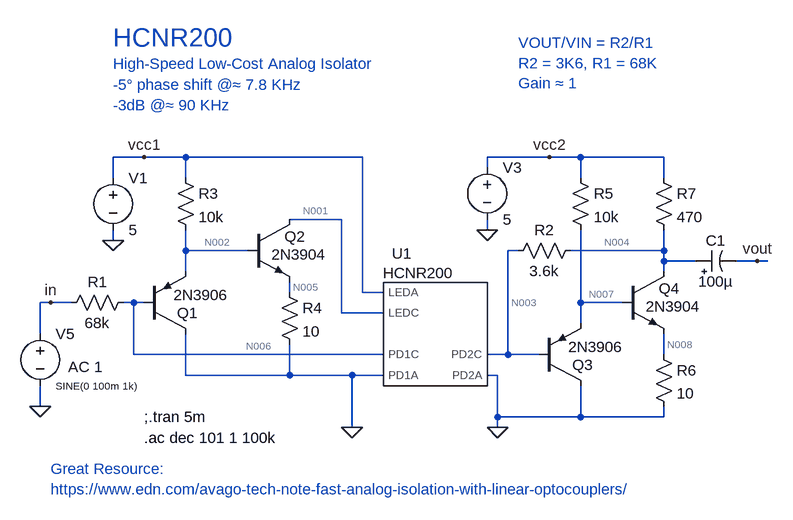
[diagram p0: schematic 03-hcnr200_hs_analog_isolator.asc]
03-hcnr200_hs_analog_isolator.asc, the LTspice schematic file:
Version 4
SHEET 1 1020 724
WIRE -32 -64 -80 -64
WIRE 32 -64 -32 -64
WIRE 304 -64 32 -64
WIRE 592 -64 496 -64
WIRE 640 -64 592 -64
WIRE 768 -64 640 -64
WIRE 496 -48 496 -64
WIRE -80 -32 -80 -64
WIRE 32 -32 32 -64
WIRE 640 -32 640 -64
WIRE 768 -32 768 -64
WIRE 272 32 192 32
WIRE 496 48 496 32
WIRE -80 64 -80 48
WIRE 32 80 32 48
WIRE 128 80 32 80
WIRE 544 80 528 80
WIRE 768 80 768 48
WIRE 768 80 624 80
WIRE 768 96 768 80
WIRE 816 96 768 96
WIRE 912 96 880 96
WIRE 928 96 912 96
WIRE 32 112 32 80
WIRE 768 112 768 96
WIRE 192 144 192 128
WIRE 304 144 304 -64
WIRE 336 144 304 144
WIRE -176 160 -192 160
WIRE -144 160 -176 160
WIRE -48 160 -64 160
WIRE -32 160 -48 160
WIRE 640 160 640 48
WIRE 704 160 640 160
WIRE 272 176 272 32
WIRE 336 176 272 176
WIRE 640 192 640 160
WIRE -192 208 -192 160
WIRE -48 240 -48 160
WIRE 336 240 -48 240
WIRE 528 240 528 80
WIRE 528 240 496 240
WIRE 576 240 528 240
WIRE 768 240 768 208
WIRE 32 272 32 208
WIRE 192 272 192 224
WIRE 192 272 32 272
WIRE 288 272 192 272
WIRE 336 272 288 272
WIRE 512 272 496 272
WIRE -192 320 -192 288
WIRE 512 336 512 272
WIRE 640 336 640 288
WIRE 640 336 512 336
WIRE 768 336 768 320
WIRE 768 336 640 336
WIRE 288 352 288 272
WIRE 512 352 512 336
FLAG -192 320 0
FLAG -176 160 in
FLAG 592 -64 vcc2
FLAG -80 64 0
FLAG 496 48 0
FLAG -32 -64 vcc1
FLAG 288 352 0
FLAG 512 352 0
FLAG 912 96 vout
SYMBOL voltage -80 -48 R0
WINDOW 123 0 0 Left 0
WINDOW 39 0 0 Left 0
SYMATTR InstName V1
SYMATTR Value 5
SYMBOL voltage -192 192 R0
WINDOW 3 24 96 Left 1
WINDOW 123 43 67 Left 2
WINDOW 39 0 0 Left 0
SYMATTR Value SINE(0 100m 1k)
SYMATTR Value2 AC 1
SYMATTR InstName V5
SYMBOL voltage 496 -64 R0
WINDOW 123 0 0 Left 0
WINDOW 39 0 0 Left 0
SYMATTR InstName V3
SYMATTR Value 5
SYMBOL res -48 144 R90
WINDOW 0 0 56 VBottom 2
WINDOW 3 32 56 VTop 2
SYMATTR InstName R1
SYMATTR Value 68k
SYMBOL pnp -32 208 M180
WINDOW 0 51 32 Left 2
WINDOW 3 45 60 Left 2
SYMATTR InstName Q1
SYMATTR Value 2N3906
SYMBOL npn 128 32 R0
WINDOW 0 56 26 Left 2
WINDOW 3 36 54 Left 2
SYMATTR InstName Q2
SYMATTR Value 2N3904
SYMBOL res 16 -48 R0
SYMATTR InstName R3
SYMATTR Value 10k
SYMBOL res 176 128 R0
SYMATTR InstName R4
SYMATTR Value 10
SYMBOL pnp 576 288 M180
WINDOW 0 51 32 Left 2
WINDOW 3 45 60 Left 2
SYMATTR InstName Q3
SYMATTR Value 2N3906
SYMBOL npn 704 112 R0
WINDOW 0 56 26 Left 2
WINDOW 3 36 54 Left 2
SYMATTR InstName Q4
SYMATTR Value 2N3904
SYMBOL res 752 224 R0
SYMATTR InstName R6
SYMATTR Value 10
SYMBOL res 640 64 R90
WINDOW 0 0 56 VBottom 2
WINDOW 3 32 56 VTop 2
SYMATTR InstName R2
SYMATTR Value 3.6k
SYMBOL res 624 -48 R0
SYMATTR InstName R5
SYMATTR Value 10k
SYMBOL res 752 -48 R0
SYMATTR InstName R7
SYMATTR Value 470
SYMBOL polcap 816 112 R270
WINDOW 0 32 32 VTop 2
WINDOW 3 0 32 VBottom 2
SYMATTR InstName C1
SYMATTR Value 100µ
SYMATTR Description Capacitor
SYMATTR Type cap
SYMATTR SpiceLine V=16 Irms=0 Rser=0.9 Lser=0 mfg="AVX" pn="TAJE107K016" type="Tantalum"
SYMBOL HCNR200 416 208 R0
SYMATTR InstName U1
TEXT -32 336 Left 2 !;.tran 5m
TEXT -32 368 Left 2 !.ac dec 101 1 100k
TEXT -80 -208 Left 2 ;High-Speed Low-Cost Analog Isolator
TEXT -80 -248 Left 4 ;HCNR200
TEXT -80 -176 Left 2 ;-5° phase shift @≈ 7.8 KHz
TEXT -80 -144 Left 2 ;-3dB @≈ 90 KHz
TEXT 544 -240 Left 2 ;VOUT/VIN = R2/R1\nR2 = 3K6, R1 = 68K\nGain ≈ 1
TEXT -176 416 Left 2 ;Great Resource:\nhttps://www.edn.com/avago-tech-note-fast-analog-isolation-with-linear-optocouplers/

The netlist it stands for:
* 03-hcnr200_hs_analog_isolator.asc
V1 vcc1 0 5
V5 in 0 SINE(0 100m 1k) AC 1
V3 vcc2 0 5
R1 N006 in 68k
Q1 0 N006 N002 0 2N3906
Q2 N001 N002 N005 0 2N3904
R3 vcc1 N002 10k
R4 N005 0 10
Q3 0 N003 N007 0 2N3906
Q4 N004 N007 N008 0 2N3904
R6 N008 0 10
R2 N004 N003 3.6k
R5 vcc2 N007 10k
R7 vcc2 N004 470
C1 N004 vout 100µ V=16 Irms=0 Rser=0.9 Lser=0 mfg="AVX" pn="TAJE107K016" type="Tantalum"
XU1 N001 vcc1 0 N006 0 N003 HCNR200  ; pins LEDC LEDA PD1A PD1C PD2A PD2C
.model NPN NPN
.model PNP PNP
.lib standard.bjt
;.tran 5m
.ac dec 101 1 100k
* High-Speed Low-Cost Analog Isolator
* HCNR200
* -5° phase shift @≈ 7.8 KHz
* -3dB @≈ 90 KHz
* VOUT/VIN = R2/R1
* R2 = 3K6, R1 = 68K
* Gain ≈ 1
* Great Resource:
* https://www.edn.com/avago-tech-note-fast-analog-isolation-with-linear-optocouplers/
.lib hcnr200.lib
.backanno
.end

* Results of the author's LTspice run, read from the files saved beside the schematic
* Operating Point, zero values left out:
*   V(vcc1) = 5 V
*   V(vcc2) = 5 V
*   V(n006) = 136 mV
*   V(n002) = 767.5 mV
*   V(n001) = 3.425 V
*   V(n005) = 63.8 mV
*   V(n003) = 187.3 mV
*   V(n007) = 817.5 mV
*   V(n004) = 289.5 mV
*   V(n008) = 100.3 mV
*   V(vout) = 28.95 µV
*   Ic(Q1) = -400.3 µA
*   Ib(Q1) = -2.001 µA
*   Ie(Q1) = 402.3 µA
*   Ic(Q3) = -380.1 µA
*   Ib(Q3) = -1.899 µA
*   Ie(Q3) = 382 µA
*   Ic(Q2) = 6.359 mA
*   Ib(Q2) = 20.97 µA
*   Ie(Q2) = -6.38 mA
*   Ic(Q4) = 9.994 mA
*   Ib(Q4) = 36.22 µA
*   Ie(Q4) = -10.03 mA
*   I(R1) = 2 µA
*   I(R3) = 423.2 µA
*   I(R4) = 6.38 mA
*   I(R6) = 10.03 mA
*   I(R2) = 28.37 µA
*   I(R5) = 418.3 µA
*   I(R7) = 10.02 mA
*   I(V1) = -6.782 mA
*   I(V5) = 2 µA
*   I(V3) = -10.44 mA
*   Ix(u1:1) = -6.359 mA
*   Ix(u1:2) = 6.359 mA
*   Ix(u1:3) = -252.8 pA
*   Ix(u1:4) = 252.8 pA
*   Ix(u1:5) = -30.27 µA
*   Ix(u1:6) = 30.27 µA
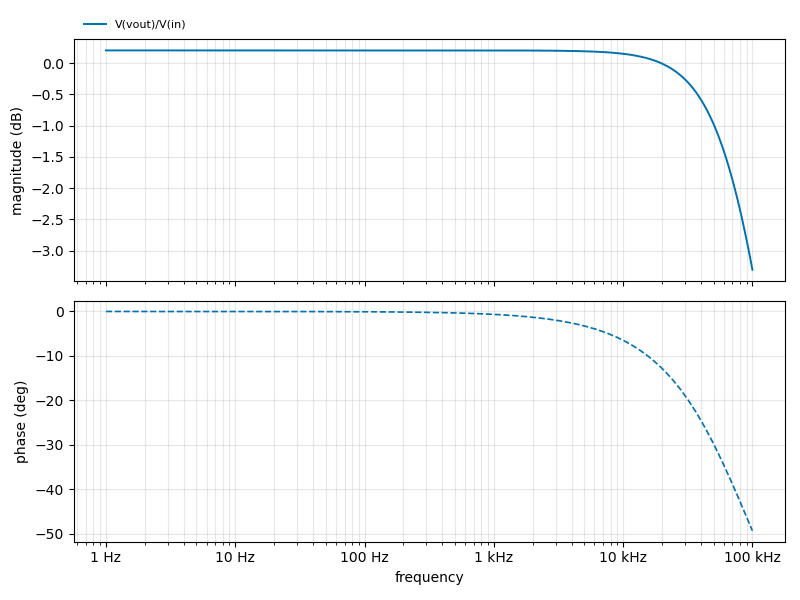
[diagram p1: AC Analysis of 03-hcnr200_hs_analog_isolator.asc, plotted from the saved traces]
* AC Analysis, 1 run:
*   V(vout)/V(in): 0.20 dB at 1 Hz, -3.31 dB at 100 kHz, peak 0.20 dB at 1 Hz, 3 dB below the peak at 89.69 kHz